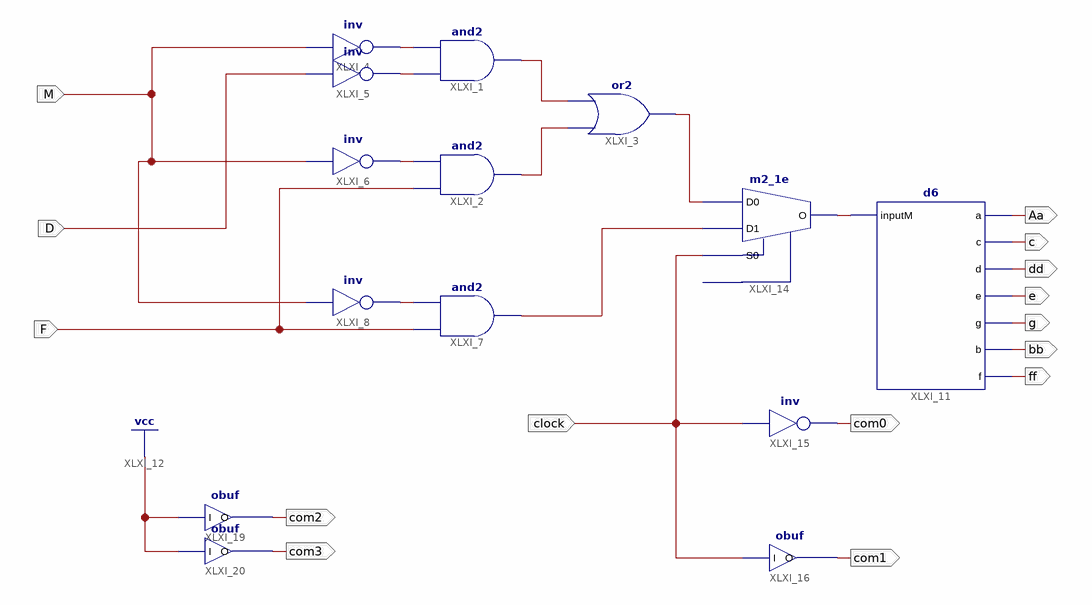
[diagram p0: schematic sheet 1]
// Xilinx ISE schematic kmitl.sch (spartan6) as structural Verilog: 14 symbols, 15 ports
module kmitl (
  input  M,
  input  D,
  input  F,
  input  clock,
  output Aa,
  output c,
  output dd,
  output e,
  output g,
  output bb,
  output ff,
  output com0,
  output com1,
  output com2,
  output com3
);

  wire A, XLXN_4, XLXN_5, XLXN_8, XLXN_9, XLXN_10, XLXN_13, XLXN_36, XLXN_37;

  and XLXI_1 (XLXN_4, XLXN_9, XLXN_8);
  and XLXI_2 (XLXN_5, F, XLXN_10);
  or XLXI_3 (XLXN_37, XLXN_5, XLXN_4);
  not XLXI_4 (XLXN_8, M);
  not XLXI_5 (XLXN_9, D);
  not XLXI_6 (XLXN_10, M);
  and XLXI_7 (A, F, XLXN_13);
  not XLXI_8 (XLXN_13, M);
  d6 XLXI_11 (.a(Aa), .b(bb), .c(c), .d(dd), .e(e), .f(ff), .g(g), .inputM(XLXN_36));
  m2_1e XLXI_14 (.D0(XLXN_37), .D1(A), .S0(clock), .O(XLXN_36));  // open: E
  not XLXI_15 (com0, clock);
  obuf XLXI_16 (.I(clock), .O(com1));
  obuf XLXI_19 (.I(1'b1), .O(com2));
  obuf XLXI_20 (.I(1'b1), .O(com3));
endmodule
